# Altium schematic sheet U_I_Meter_TOP.SchDoc
size A2; SheetNumber: 1; SheetTotal: 1; SPICEModelCacheKLKQCPMB: <root> / <DocumentId>KLKQCPMB</DocumentId> / <CacheFrame Number="0"> / <Model Name="5848_744774033_3.3u" Kind="CKT"> / <Text>******* / .subckt 5848_744774033_3.3u 1 2 / Rp 1 2 12000 / Cp 1 2 3.4p / Rs 1 N3 0.042 / L1 N3 2 3.3u / .ends 5848_744774033_3.3u</Text> / </Model> / </CacheFrame> / </root>
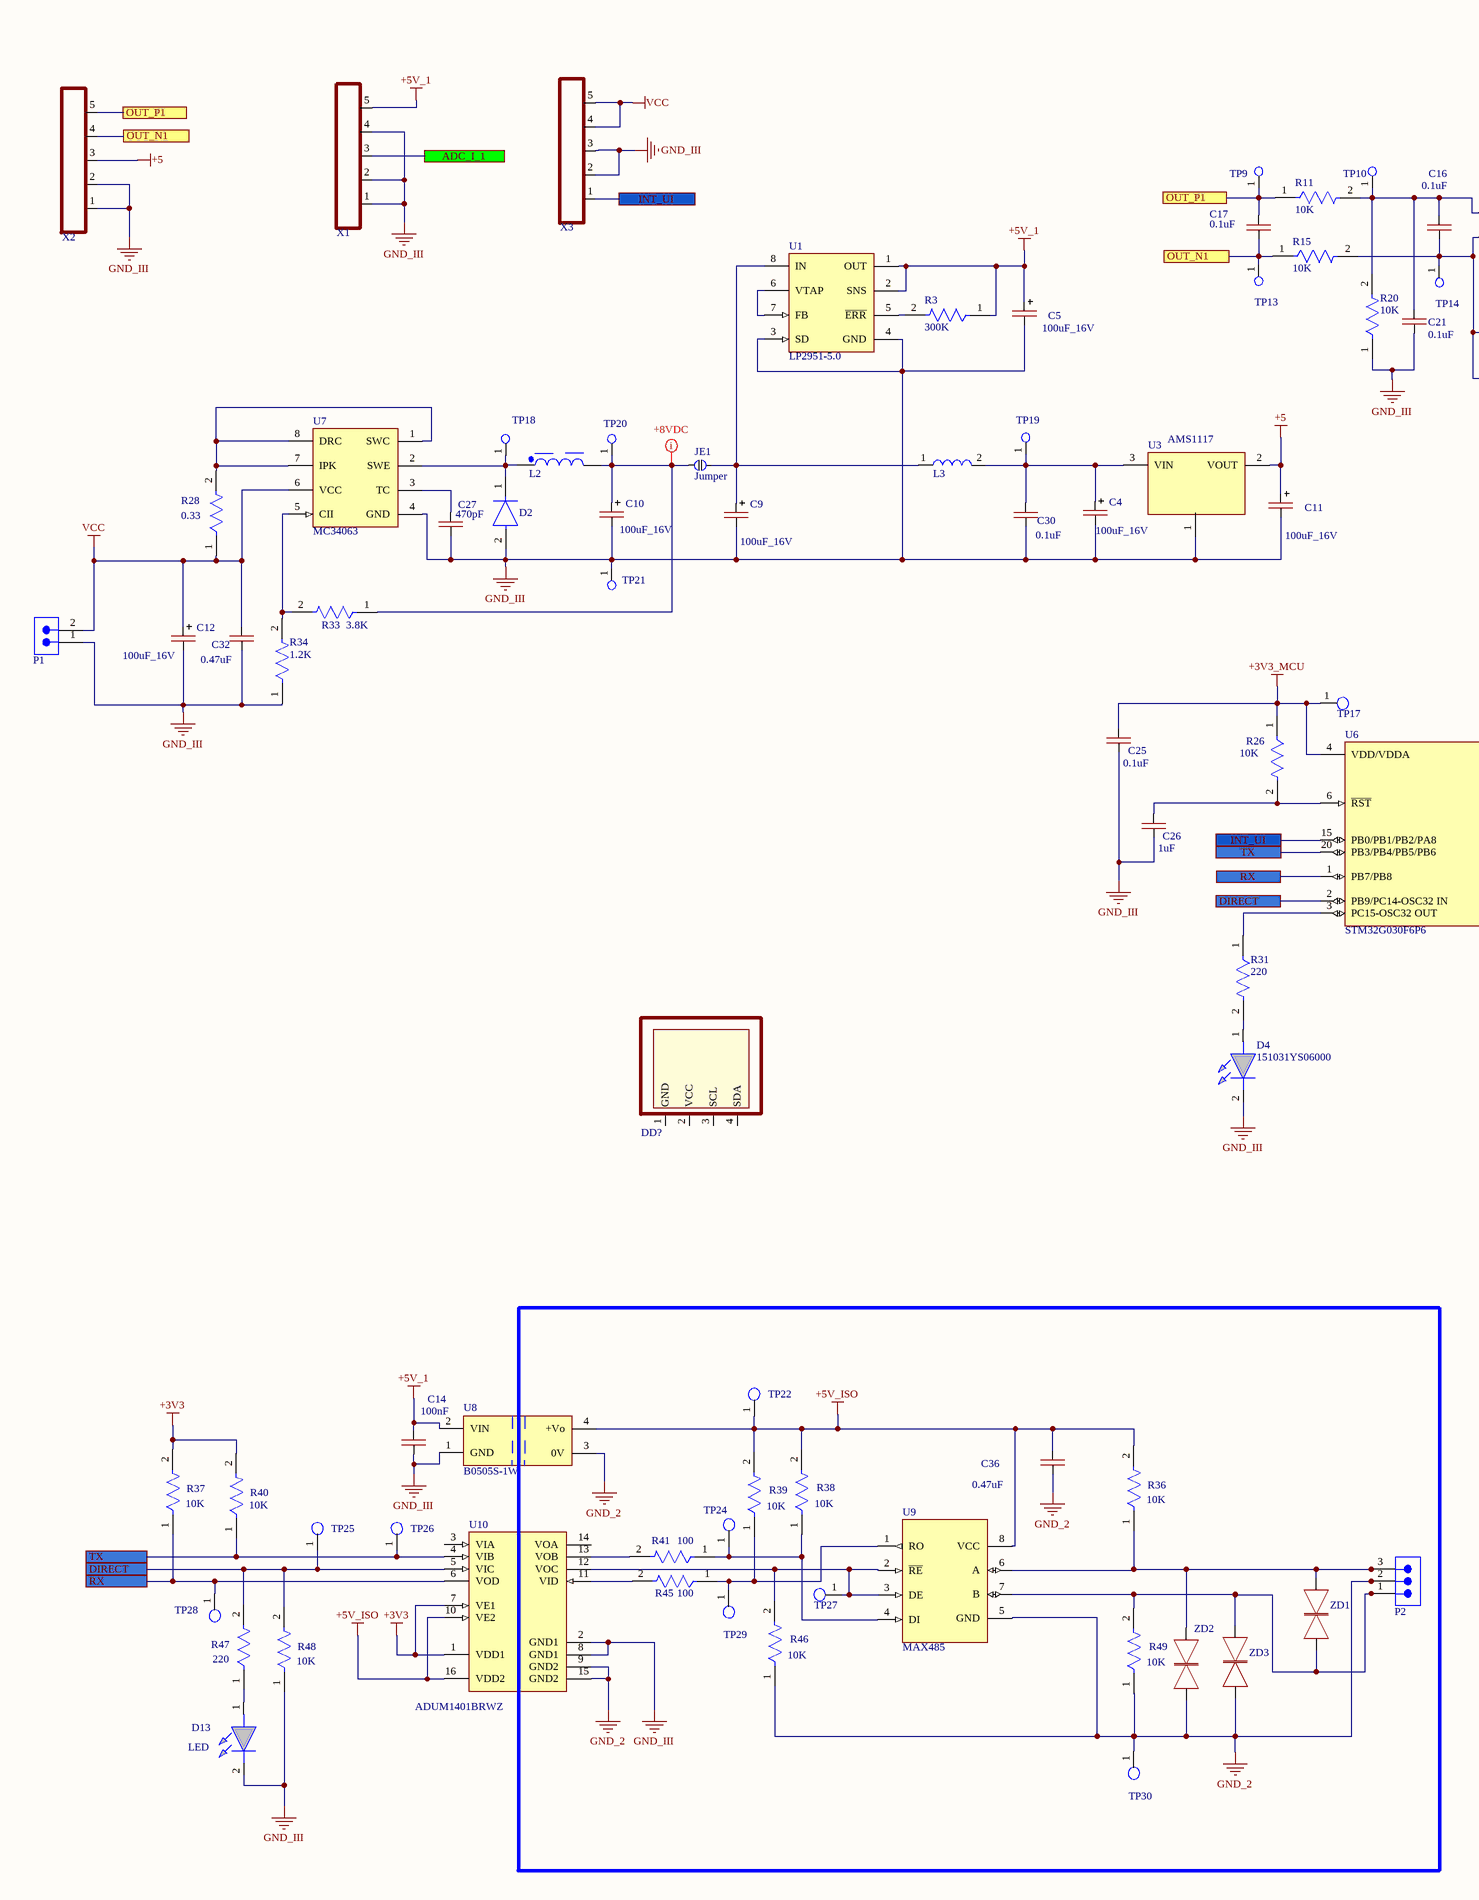
[diagram p0: U_I_Meter_TOP.SchDoc, left]
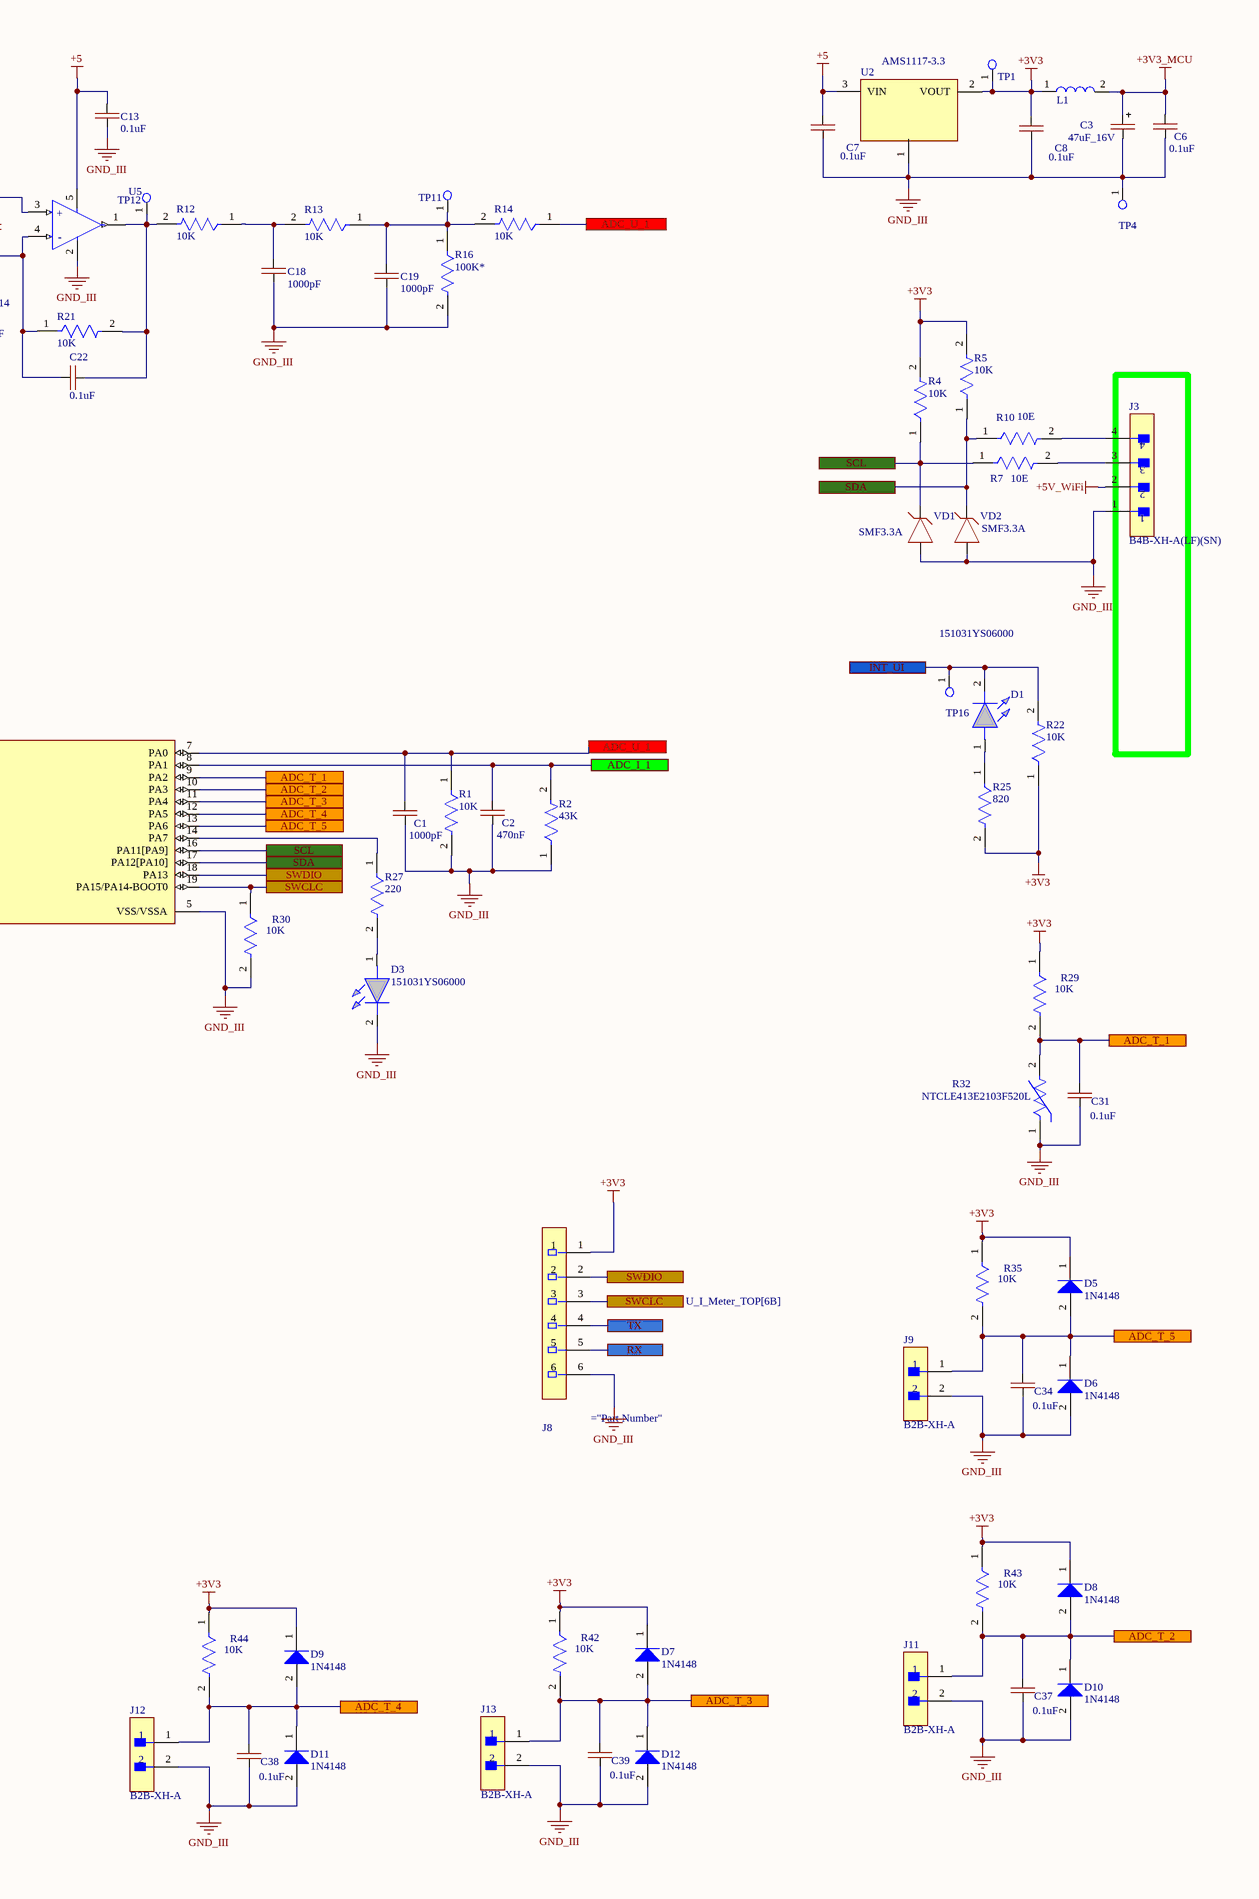
[diagram p1: U_I_Meter_TOP.SchDoc, right]

## Parts
C1  1000pF  [CAP-0805]
C2  470nF  [CAP-0805]
C3  47uF_16V  [CAP-TAN-D]
C4  100uF_16V  [CAP-TAN-D]
C5  100uF_16V  [CAP-TAN-D]
C6  0.1uF  [CAP-0805]
C7  0.1uF  [CAP-0805]
C8  0.1uF  [CAP-0805]
C9  100uF_16V  [CAP-TAN-D]
C10  100uF_16V  [1000uF_10V_Size_F]
C11  100uF_16V  [CAP-TAN-D]
C12  100uF_16V  [CAP-TAN-D]
C13  0.1uF  [CAP-0805]
C14  100nF  [CAP-0805]
C16  0.1uF  [CAP-0805]
C17  0.1uF  [CAP-0805]
C18  1000pF  [CAP-0805]
C19  1000pF  [CAP-0805]
C21  0.1uF  [CAP-0805]
C22  0.1uF  [CAP-0805]
C25  0.1uF  [CAP-0805]
C26  1uF  [CAP-0805]
C27  470pF  [CAP-0805]
C30  0.1uF  [CAP-0805]
C31  0.1uF  [CAP-0805]
C32  0.47uF  [CAP-0805]
C34  0.1uF  [CAP-0805]
C36  0.47uF  [CAP-0805]
C37  0.1uF  [CAP-0805]
C38  0.1uF  [CAP-0805]
C39  0.1uF  [CAP-0805]
D1  151031YS06000  [LED_3mm_BLUE]
D2  ES1G  [FP-403AE-MFG]  (value not drawn)
D3  151031YS06000  [LED_3mm_GREEN]
D4  151031YS06000  [LED_3mm_RED]
D5  1N4148  [DIOD-SOD123-2_V]
D6  1N4148  [DIOD-SOD123-2_V]
D7  1N4148  [DIOD-SOD123-2_V]
D8  1N4148  [DIOD-SOD123-2_V]
D9  1N4148  [DIOD-SOD123-2_V]
D10  1N4148  [DIOD-SOD123-2_V]
D11  1N4148  [DIOD-SOD123-2_V]
D12  1N4148  [DIOD-SOD123-2_V]
D13  LED  [LED_3mm_BLUE]
DD?  OLED_SSD_1306  [OLED_128x64_SSD_1306]  (value not drawn)
J3  B4B-XH-A(LF)(SN)  [B4B-XH-A]
J8  SWR25X-NRTC-S06-ST-BA  [Sullins_SWR25X-NRTC-S06-ST-BA_MFG]  (value not drawn)
J9  B2B-XH-A  [B2B-XH-A]
J11  B2B-XH-A  [B2B-XH-A]
J12  B2B-XH-A  [B2B-XH-A]
J13  B2B-XH-A  [B2B-XH-A]
JE1  Jumper  [JE]
L1  Coil  [Coil_4.5x4.5_mm]  (value not drawn)
L2  3.3µH, 4A  [WE-PD2_5848]  (value not drawn)
L3  Coil  [Coil_4.5x4.5_mm]  (value not drawn)
P1  691701530002B  [691701530002B]  (value not drawn)
P2  691701530003B  [691701530003B]  (value not drawn)
R1  10K  [RES-0805]
R2  43K  [RES-0805]
R3  300K  [RES-0805]
R4  10K  [RES-0805]
R5  10K  [RES-0805]
R7  10E  [RES-0805]
R10  10E  [RES-0805]
R11  10K  [RES-0805]
R12  10K  [RES-0805]
R13  10K  [RES-0805]
R14  10K  [RES-0805]
R15  10K  [RES-0805]
R16  100K*  [RES-0805]
R20  10K  [RES-0805]
R21  10K  [RES-0805]
R22  10K  [RES-0805]
R25  820  [RES-0805]
R26  10K  [RES-0805]
R27  220  [RES-0805]
R28  0.33  [RES-1206]
R29  10K  [RES-0805]
R30  10K  [RES-0805]
R31  220  [RES-0805]
R32  NTCLE413E2103F520L  [FP-NTCLE413E2103F520L-MFG]
R33  3.8K  [RES-0805]
R34  1.2K  [RES-0805]
R35  10K  [RES-0805]
R36  10K  [RES-0805]
R37  10K  [RES-0805]
R38  10K  [RES-0805]
R39  10K  [RES-0805]
R40  10K  [RES-0805]
R41  100  [RES-0805]
R42  10K  [RES-0805]
R43  10K  [RES-0805]
R44  10K  [RES-0805]
R45  100  [RES-0805]
R46  10K  [RES-0805]
R47  220  [RES-0805]
R48  10K  [RES-0805]
R49  10K  [RES-0805]
TP1  Test_Point_PCB  [Test_Point]  (value not drawn)
TP4  Test_Point_PCB  [Pin_Test_Point(Pink)]  (value not drawn)
TP9  Test_Point_PCB  [Test_Point]  (value not drawn)
TP10  Test_Point_PCB  [Test_Point]  (value not drawn)
TP11  Test_Point_PCB  [Test_Point]  (value not drawn)
TP12  Test_Point_PCB  [Test_Point]  (value not drawn)
TP13  Test_Point_PCB  [Test_Point]  (value not drawn)
TP14  Test_Point_PCB  [Test_Point]  (value not drawn)
TP16  Test_Point_PCB  [Test_Point]  (value not drawn)
TP17  (no value)  [Test_Point]
TP18  Test_Point_PCB  [Test_Point]  (value not drawn)
TP19  Test_Point_PCB  [Test_Point]  (value not drawn)
TP20  Test_Point_PCB  [Test_Point]  (value not drawn)
TP21  Test_Point_PCB  [Pin_Test_Point(Orange)]  (value not drawn)
TP22  Test_Point_PCB  [Test_Point]  (value not drawn)
TP24  Test_Point_PCB  [Test_Point]  (value not drawn)
TP25  Test_Point_PCB  [Test_Point]  (value not drawn)
TP26  Test_Point_PCB  [Test_Point]  (value not drawn)
TP27  Test_Point_PCB  [Test_Point]  (value not drawn)
TP28  Test_Point_PCB  [Test_Point]  (value not drawn)
TP29  (no value)  [Test_Point]
TP30  Test_Point_PCB  [Test_Point]  (value not drawn)
U1  LP2951-5.0  [SOIC-8_L]
U2  AMS1117-3.3  [SOT-223]
U3  AMS1117  [SOT-89]
U5  (no value)  [SOT-23-5]
U6  STM32G030F6P6  [FP-TSSOP20-YA-IPC_A]
U7  MC34063  [SOIC-8_M]
U8  B0505S-1W  [B0505S-1W]
U9  MAX485  [SOIC-8-MFG]
U10  ADUM1401BRWZ  [ADI-RW-16_M]
VD1  SMF3.3A  [SMF3.3A]
VD2  SMF3.3A  [SMF3.3A]
X1  CONN-5-PIN  [CONN-PLS-5-2.54_2]  (value not drawn)
X2  CONN-5-PIN  [CONN-PLS-5-2.54_2]  (value not drawn)
X3  CONN-5-PIN  [CONN-PLS-5-2.54_2]  (value not drawn)
ZD1  P6SMB16CA  [DO-214AA]  (value not drawn)
ZD2  P6SMB16CA  [DO-214AA]  (value not drawn)
ZD3  P6SMB16CA  [DO-214AA]  (value not drawn)

## Ports
ADC_I_1 (see U_I_Meter_TOP[2A]), ADC_I_1 (see U_I_Meter_TOP[7B]), ADC_T_1 (see U_I_Meter_TOP[6B]), ADC_T_1 (see U_I_Meter_TOP[8C]), ADC_T_2 (see U_I_Meter_TOP[6B]), ADC_T_2 (see U_I_Meter_TOP[8D]), ADC_T_3 (see U_I_Meter_TOP[6B]), ADC_T_3 (see U_I_Meter_TOP[7D]), ADC_T_4 (see U_I_Meter_TOP[6B]), ADC_T_4 (see U_I_Meter_TOP[6D]), ADC_T_5 (see U_I_Meter_TOP[6B]), ADC_T_5 (see U_I_Meter_TOP[8C]), ADC_U_1 (see U_I_Meter_TOP[7A]), ADC_U_1 (see U_I_Meter_TOP[7B]), DIRECT (see U_I_Meter_TOP[1D]), DIRECT (see U_I_Meter_TOP[4B]), INT_UI (see U_I_Meter_TOP[2A], U_I_Meter_TOP[4B]), INT_UI (see U_I_Meter_TOP[2A], U_I_Meter_TOP[7B]), INT_UI (see U_I_Meter_TOP[4B], U_I_Meter_TOP[7B]), OUT_N1 (see U_I_Meter_TOP[1A]), OUT_N1 (see U_I_Meter_TOP[4A]), OUT_P1 (see U_I_Meter_TOP[1A]), OUT_P1 (see U_I_Meter_TOP[4A]), RX (see U_I_Meter_TOP[1D], U_I_Meter_TOP[4B]), RX (see U_I_Meter_TOP[1D], U_I_Meter_TOP[7C]), RX (see U_I_Meter_TOP[4B], U_I_Meter_TOP[7C]), SCL (see U_I_Meter_TOP[6B]), SCL (see U_I_Meter_TOP[7A]), SDA (see U_I_Meter_TOP[6B]), SDA (see U_I_Meter_TOP[7A]), SWCLC (see U_I_Meter_TOP[6B]), SWCLC (see U_I_Meter_TOP[7C]), SWDIO (see U_I_Meter_TOP[6B]), SWDIO (see U_I_Meter_TOP[7C]), TX (see U_I_Meter_TOP[1D], U_I_Meter_TOP[4B]), TX (see U_I_Meter_TOP[1D], U_I_Meter_TOP[7C]), TX (see U_I_Meter_TOP[4B], U_I_Meter_TOP[7C])

## Nets
+3V3: C8.2 D5.1(K) D7.1(K) D8.1(K) D9.1(K) J8.1 L1.1 R4.2 R5.2 R22.1 R25.2 R29.1 R35.1 R37.2 R40.2 R42.1 R43.1 R44.1 TP1.1(G9) U2.2(VOUT) U10.1(VDD1) U10.7(VE1)
+3V3_MCU: C3.1(+) C6.2 C25.2 L1.2 R26.1 TP17.1(G9) U6.4(VDD/VDDA)
+5: C7.2 C11.1(+) C13.2 U2.3(VIN) U3.2(VOUT) U5.5(VDD) X2.3
+5V_1: C5.1(+) C14.2 R3.1 U1.1(OUT) U1.2(SNS) U8.2(VIN) X1.5
+5V_ISO: C36.1 R36.2 R38.2 R39.2 TP22.1(G9) U8.4(+Vo) U9.8(VCC) U10.10(VE2) U10.16(VDD2)
+5V_WiFi: J3.2
GND_2: C36.2 P2.2 R46.1 R49.1 TP30.1(G9) U8.3(0V) U9.5(GND) U10.9(GND2) U10.15(GND2) ZD2.1(A) ZD3.1(A)
GND_III: C1.1 C2.1 C3.2(-) C4.2(-) C5.2(-) C6.1 C7.1 C8.1 C9.2(-) C10.2(-) C11.2(-) C12.2(-) C13.1 C14.1 C18.1 C19.1 C21.1 C25.1 C26.1 C27.2 C30.1 C31.1 C32.2 C34.1 C37.1 C38.1 C39.1 D2.2(A) D3.2(K) D4.2(K) D6.2(A) D10.2(A) D11.2(A) D12.2(A) D13.2(K) J3.1 J8.6 J9.2 J11.2 J12.2 J13.2 P1.1 R1.2 R2.1 R16.2 R20.1 R30.2 R32.1 R34.1 R48.1 TP4.1(G9) TP21.1(G9) U1.3(SD) U1.4(GND) U2.1(Ground) U3.1(Ground) U5.2(VSS) U6.5(VSS/VSSA) U7.4(GND) U8.1(GND) U10.2(GND1) U10.8(GND1) VD1.1(A) VD2.1(A) X1.1 X1.2 X1.4 X2.1 X2.2 X3.2 X3.3
VCC: C12.1(+) C32.1 P1.2 R28.1 U7.6(VCC) X3.4 X3.5
ADC_I_1: C2.2 R2.2 U6.8(PA1) X1.3 ; port ADC_I_1
ADC_T_1: C31.2 R29.2 R32.2 U6.9(PA2) ; port ADC_T_1
ADC_T_2: C37.2 D8.2(A) D10.1(K) J11.1 R43.2 U6.10(PA3) ; port ADC_T_2
ADC_T_3: C39.2 D7.2(A) D12.1(K) J13.1 R42.2 U6.11(PA4) ; port ADC_T_3
ADC_T_4: C38.2 D9.2(A) D11.1(K) J12.1 R44.2 U6.12(PA5) ; port ADC_T_4
ADC_T_5: C34.2 D5.2(A) D6.1(K) J9.1 R35.2 U6.13(PA6) ; port ADC_T_5
ADC_U_1: C1.2 R1.1 R14.1 U6.7(PA0) ; port ADC_U_1
DIRECT: R47.2 R48.2 TP25.1(G9) U6.2(PB9/PC14-OSC32_IN) U10.5(VIC) ; port DIRECT
INT_UI: D1.2(K) R22.2 TP16.1(G9) U6.15(PB0/PB1/PB2/PA8) X3.1 ; port INT_UI
OUT_N1: C17.1 R15.1 TP13.1(G9) X2.4 ; port OUT_N1
OUT_P1: C17.2 R11.1 TP9.1(G9) X2.5 ; port OUT_P1
RX: J8.5 R37.1 TP28.1(G9) U6.1(PB7/PB8) U10.6(VOD) ; port RX
SCL: R4.1 R7.1 U6.16(PA11[PA9]) VD1.2(C) ; port SCL
SDA: R5.1 R10.1 U6.17(PA12[PA10]) VD2.2(C) ; port SDA
SWCLC: J8.3 R30.1 U6.19(PA15/PA14-BOOT0) ; port SWCLC
SWDIO: J8.2 U6.18(PA13) ; port SWDIO
TX: J8.4 R40.1 TP26.1(G9) U6.20(PB3/PB4/PB5/PB6) U10.4(VIB) ; port TX
NetC4_1: C4.1(+) C30.2 L3.2 TP19.1(G9) U3.3(VIN)
NetC9_1: C9.1(+) JE1.1 L3.1 U1.8(IN)
NetC10_1: C10.1(+) JE1.2 L2.2 R33.1 TP20.1(G9)
NetC16_1: C16.1 C22.1 R15.2 R21.1 TP14.1(G9) U5.4(VIN-)
NetC16_2: C16.2 C21.2 R11.2 R20.2 TP10.1(G9) U5.3(VIN+)
NetC18_2: C18.2 R12.1 R13.2
NetC19_2: C19.2 R13.1 R14.2 R16.1 TP11.1(G9)
NetC22_2: C22.2 R12.2 R21.2 TP12.1(G9) U5.1(VOUT)
NetC26_2: C26.2 R26.2 U6.6(~{RST})
NetC27_1: C27.1 U7.3(TC)
NetD1_1: D1.1(A) R25.1
NetD2_1: D2.1(C) L2.1 TP18.1(G9) U7.2(SWE)
NetD3_1: D3.1(A) R27.2
NetD4_1: D4.1(A) R31.2
NetD13_1: D13.1(A) R47.1
NetJ3_3: J3.3 R7.2
NetJ3_4: J3.4 R10.2
NetP2_1: P2.1 R49.2 U9.7(B) ZD1.1(A) ZD3.2(A)
NetP2_3: P2.3 R36.1 U9.6(A) ZD1.2(A) ZD2.2(A)
NetR3_2: R3.2 U1.5(~{ERR})
NetR27_1: R27.1 U6.14(PA7)
NetR28_2: R28.2 U7.1(SWC) U7.7(IPK) U7.8(DRC)
NetR31_1: R31.1 U6.3(PC15-OSC32_OUT)
NetR33_2: R33.2 R34.2 U7.5(CII)
NetR38_1: R38.1 R41.1 TP24.1(G9) U9.4(DI)
NetR39_1: R39.1 R45.1 TP29.1(G9) U9.1(RO)
NetR41_2: R41.2 U10.13(VOB)
NetR45_2: R45.2 U10.11(VID)
NetR46_2: R46.2 TP27.1(G9) U9.2(~{RE}) U9.3(DE) U10.12(VOC)
NetU1_6: U1.6(VTAP) U1.7(FB)

Not connected (* = marked no-connect by the designer): DD? 1(GND) 2(VCC) 3(SCL) 4(SDA); U10 3(VIA) 14(VOA)

## Layout directives
mark named +8VDC: (no net found under the mark)

## Notes on the sheet
- (in symbol MCP6001T) +; -

## Library data of the parts
C1 C2 C6-C8 C13 C14 C16-C19 C21 C22 C25-C27 C30-C32 C34 C36-C39 = CAP-NON-POLAR
C3 = CAP-POLAR
C4 C5 C9-C12 = CAP_POL_SMD
D1 D3 D4 D13 = LED: WURTH ELEKTRONIK - 151031YS06000 - LED, Yellow, Through Hole, T-1 (3mm), 30 mA, 2 V, 590 nm; Geometry.Height: 5.5mm; Manufacturer_Name: Wurth Elektronik; Manufacturer_Part_Number: 151031YS06000; Mouser Part Number: 710-151031YS06000; Mouser Price/Stock: https://www.mouser.co.uk/ProductDetail/Wurth-Elektronik/151031YS06000?qs=LlUlMxKIyB3xSYYW%252BcuBiQ%3D%3D; Arrow Part Number: *; Arrow Price/Stock: *; Mouser Testing Part Number: *; Mouser Testing Price/Stock: *; Datasheet Link: https://katalog.we-online.de/led/datasheet/151031YS06000.pdf
D2 = ES1G: Ultrafast
JE1 = JE
L2 = 744774033: WE-PD2 SMT Power Inductor, size 5848, 3.3µH, 4A, 0.06Ω; Manufacturer: Wurth Elektronik; Case/Size Code: 5848; DC Resistance: 0.042Ω; Saturation Current: 7.5A; Self Resonant Frequency: 43MHz; Manufacturer Part Number: 744774033; Category: Unshielded Power Inductors; Match Code: WE-PD2; ComponentLink1Description: Website Link; ComponentLink1URL: https://www.we-online.com/redexpert/article/744774033?ad; ComponentLink2Description: Datasheet Link; ComponentLink2URL: https://www.we-online.com/redexpert/spec/744774033?ad; Mount: Surface Mount; Operating Temperature Max: 125°C; Operating Temperature Min: -40°C; Packaging: Tape and Reel; Length: 5.8mm; Width: 5.2mm; Height: 4.5mm; DC Resistance Max: 0.06Ω; Inductance: 3.3µH; Rated Current: 4A
P1 = 691701530002B: WR-TBL Series 7015B Open Horizontal PCB Header, SMT, pitch 5.08mm, 2p; Manufacturer: Wurth Elektronik; Modularity: No; Rated Current: 10A; Working Voltage: 300V; ComponentLink1Description: Website Link; ComponentLink1URL: https://www.we-online.com/redexpert/article/691701530002B?ad; ComponentLink2Description: Datasheet Link; ComponentLink2URL: https://www.we-online.com/redexpert/spec/691701530002B?ad; Manufacturer Part Number: 691701530002B; Category: Terminal Blocks; Match Code: WR-TBL; Mount: Surface Mount; Operating Temperature Max: 105°C; Operating Temperature Min: -40°C; Packaging: Box; Application: Pluggable; Number of Pins: 2; Number of Rows: 1; Orientation: Horizontal; Pitch: 5.08mm
P2 = 691701530003B: WR-TBL Series 7015B Open Horizontal PCB Header, SMT, pitch 5.08mm, 3p; Manufacturer: Wurth Elektronik; Modularity: No; Rated Current: 10A; Working Voltage: 300V; ComponentLink1Description: Website Link; ComponentLink1URL: https://www.we-online.com/redexpert/article/691701530003B?ad; ComponentLink2Description: Datasheet Link; ComponentLink2URL: https://www.we-online.com/redexpert/spec/691701530003B?ad; Manufacturer Part Number: 691701530003B; Category: Terminal Blocks; Match Code: WR-TBL; Mount: Surface Mount; Operating Temperature Max: 105°C; Operating Temperature Min: -40°C; Packaging: Box; Application: Pluggable; Number of Pins: 3; Number of Rows: 1; Orientation: Horizontal; Pitch: 5.08mm
R1-R5 R7 R10-R16 R20-R22 R26-R31 R34-R49 = RES-CONST
R25 = RES-CONST: 220
R32 = CMP-02404-000010-1: THERMISTOR NTC 10KOHM 3435K BEAD; Accuracy: 1%; Lead Diameter: 1mm; Resistance: 10kR; Max Power Dissipation: 250mW; Max Operating Temperature: 105°C; Termination: Through Hole; Mount: Through Hole; Packaging: Bulk; Package Quantity: 1000; RoHS Compliant: Yes; Resistance Tolerance: 1%; Number of Pins: 2; Radiation Hardening: No; Min Operating Temperature: -40°C; Tolerance: 1%
R33 = RES-CONST: 10K
TP1 TP4 TP9-TP14 TP16-TP22 TP24-TP30 = TP_PCB?: Test_Point
U1 = LP2951-3.3
U2 = AMS1117
U5 = MCP6001T: IC OPAMP GP 1 CIRCUIT SOT23-5; Number of Amplifiers: 1; Voltage: 6V; Power Supply Rejection Ratio (PSRR): 86dB; Common Mode Rejection Ratio: 60dB; Unity Gain Bandwidth Product: 1MHz; Slew Rate: 0.6V/µs; Output Current per Channel: 23mA; Nominal Supply Current: 100uA; Input Offset Voltage (Vos): 4.5mV; Input Bias Current: 1pA; Operating Supply Voltage: 5.5V; Min Supply Voltage: 1.8V; Voltage Gain: 112dB; Length: 3.1mm; REACH SVHC: No SVHC; Number of Pins: 5; Package Quantity: 1; Radiation Hardening: No; Mount: Surface Mount; Number of Circuits: 1; Number of Elements: 1; Output Current: 23mA; Packaging: Tape and Reel; Height: 1.3mm; Lead Free: Lead Free; Min Operating Temperature: -40°C; Bandwidth: 1MHz; Contact Plating: Tin; Max Supply Voltage: 6V; Max Operating Temperature: 85°C; Width: 1.8mm; Case/Package: SOT-23; Operating Supply Current: 100uA; Number of Channels: 1; Gain Bandwidth Product: 1MHz
U6 = STM32G030F6P6: SOIC-20
U10 = CMP-0534-00565-1: Quad Channel Digital Isolator, 2.5 KV rms Insulation Rating, 10 Mbps Data Rate, 50 ns Delay, Industrial, 16-pin SOIC (RW-16), Tube; Manufacturer: Analog Devices; Max Data Rate: 10Mbps; ComponentLink2URL: http://www.analog.com/static/imported-files/data_sheets/ADuM1400_1401_1402.pdf; ComponentLink5Description: URL Link2; ComponentLink3URL: http://www.analog.com/static/imported-files/packages/PKG_PDF/SOIC_WIDE%20%28RW%29/RW_16.pdf; DatasheetVersion: Rev. H; ComponentLink2Description: Datasheet; ComponentLink3Description: Package Specification; PartNumber: ADUM1401BRWZ; ComponentLink5URL: Reference Circuit:http://www.analog.com/en/interface-isolation/digital-isolators/adum1401/products/product.html#product-recommendations; Max Operating Temp (degreesC): 125; PackageReference: RW-16; PackageVersion: 032707-B, 03/2007; ComponentLink1Description: Manufacturer URL; Code_JEDEC: MS-013-AA; PackageDescription: 16-Pin Standard Small Outline Package, Body 10.3 x 7.5 mm, Pitch 1.27 mm; Mounting Technology: Surface Mount; ComponentLink1URL: http://www.analog.com/en/index.html; ComponentLink4Description: URL Link1; ComponentLink4URL: Product URL:http://www.analog.com/en/interface-isolation/digital-isolators/adum1401/products/product.html
VD1 VD2 = ESD_Unidirect